# EAGLE design SENSOR (EAGLE 7.5.0)
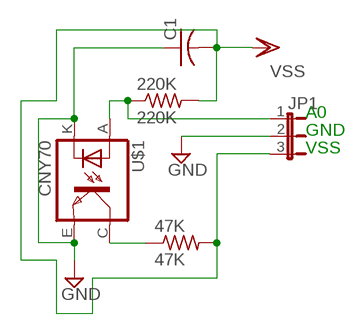
[diagram p0: schematic, sheet 1]

## Parts
47K  47K  R-US_0309/12  [0309/12]
220K  220K  R-US_0309/12  [0309/12]
C1  C-US025-030X050  [C025-030X050]
JP1  JP2E  [JP2]
U$1  CNY70  [4]

## Nets
GND: C1.1 JP1.2 U$1.E(EMI) U$1.K(C)
N$1: 220K.1 JP1.1 U$1.A
N$2: 47K.1 U$1.C(COL)
VSS: 47K.2 220K.2 C1.2 JP1.3

## Notes on the sheet
- A0
- GND
- VSS

## Library data of the parts
47K 220K = rcl:R-US_: RESISTOR, American symbol
C1 = rcl:C-US: CAPACITOR, American symbol
JP1 = jumper:JP2E: JUMPER
U$1 = cny70:CNY70

## Board
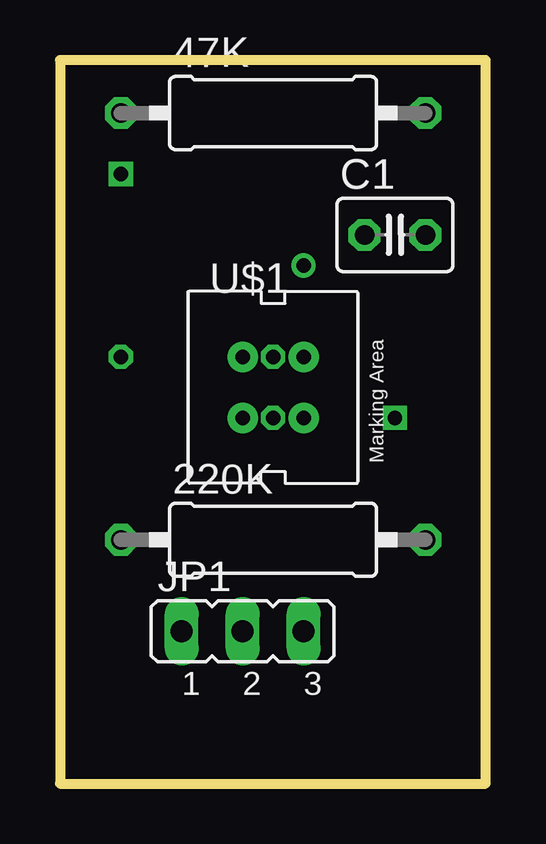
[diagram p1: board, top side]
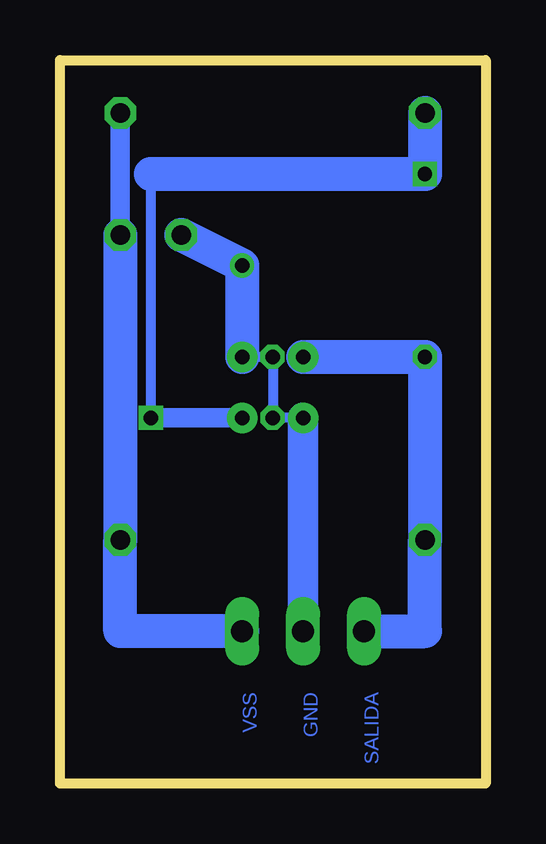
[diagram p2: board, bottom side, seen from below]

Size 17.76 x 30.15 mm. Coordinates in mm from the lower left corner, seen from the top.
Outline: 0,0 17.76,0 17.76,30.15 0,30.15 0,0
Copper layers (1*16): Top 0.035mm / dielectric 1.5mm / Bottom 0.035mm
Design rules "default": minimum track width 10mil, minimum drill 24mil, track to track 8mil, track to pad 8mil, pad to pad 8mil, via to via 8mil, smd to smd 8mil, copper to edge 40mil, drill to drill 8mil, minimum pad ring 10mil, minimum via ring 8mil, stop-mask expansion 4mil, vias tented up to drill 0mil, thermal gap 10mil

### Footprints (pad centres in the part's own frame; a part is rotated, then mirrored left to right if it is on the bottom)
0309/12 = drill 0.813 octagon: 1 -6.35,0; 2 6.35,0
C025-030X050 = drill 0.813 octagon: 1 -1.27,0; 2 1.27,0
JP2 = drill 0.914 long: 1 -2.54,0; 2 0,0; 3 2.54,0
4 = drill 0.61 pad 1.27: A -1.27,1.27; C 1.27,-1.27; E 1.27,1.27; K -1.27,-1.27

### Placement (x,y rotation side)
47K  8.89,27.94 0 top
220K  8.89,10.16 0 top
C1  13.97,22.86 0 top
JP1  7.62,6.35 0 top
U$1  8.89,16.51 0 top

### Tracks (layer width: path | path; a pad name or v marks a point on that pad's centre or on a via)
GND  (via drill 0.6 pad 0.3)
  Bottom 0.406: U$1.E arc5 v8.89,17.78 arc5 v8.89,15.24 U$1.K
  Bottom 1.27: JP1.2 U$1.K
  Bottom 1.422: C1.1 v10.16,21.59 U$1.E
N$1  (via drill 0.6 pad 0.3)
  Bottom 1.422: JP1.1 2.54,6.35 220K.1 v2.54,17.78 U$1.A
N$2  (via drill 0.6 pad 0.3)
  Bottom 0.406: 13.97,25.4 v13.97,15.24
  Bottom 0.813: v13.97,15.24 U$1.C
  Bottom 1.422: 47K.1 v2.54,25.4 13.97,25.4
VSS
  Bottom 0.813: 47K.2 C1.2
  Bottom 1.422: C1.2 220K.2 15.24,6.35 JP1.3

### Text on the board
Bottom: SALIDA | GND | VSS